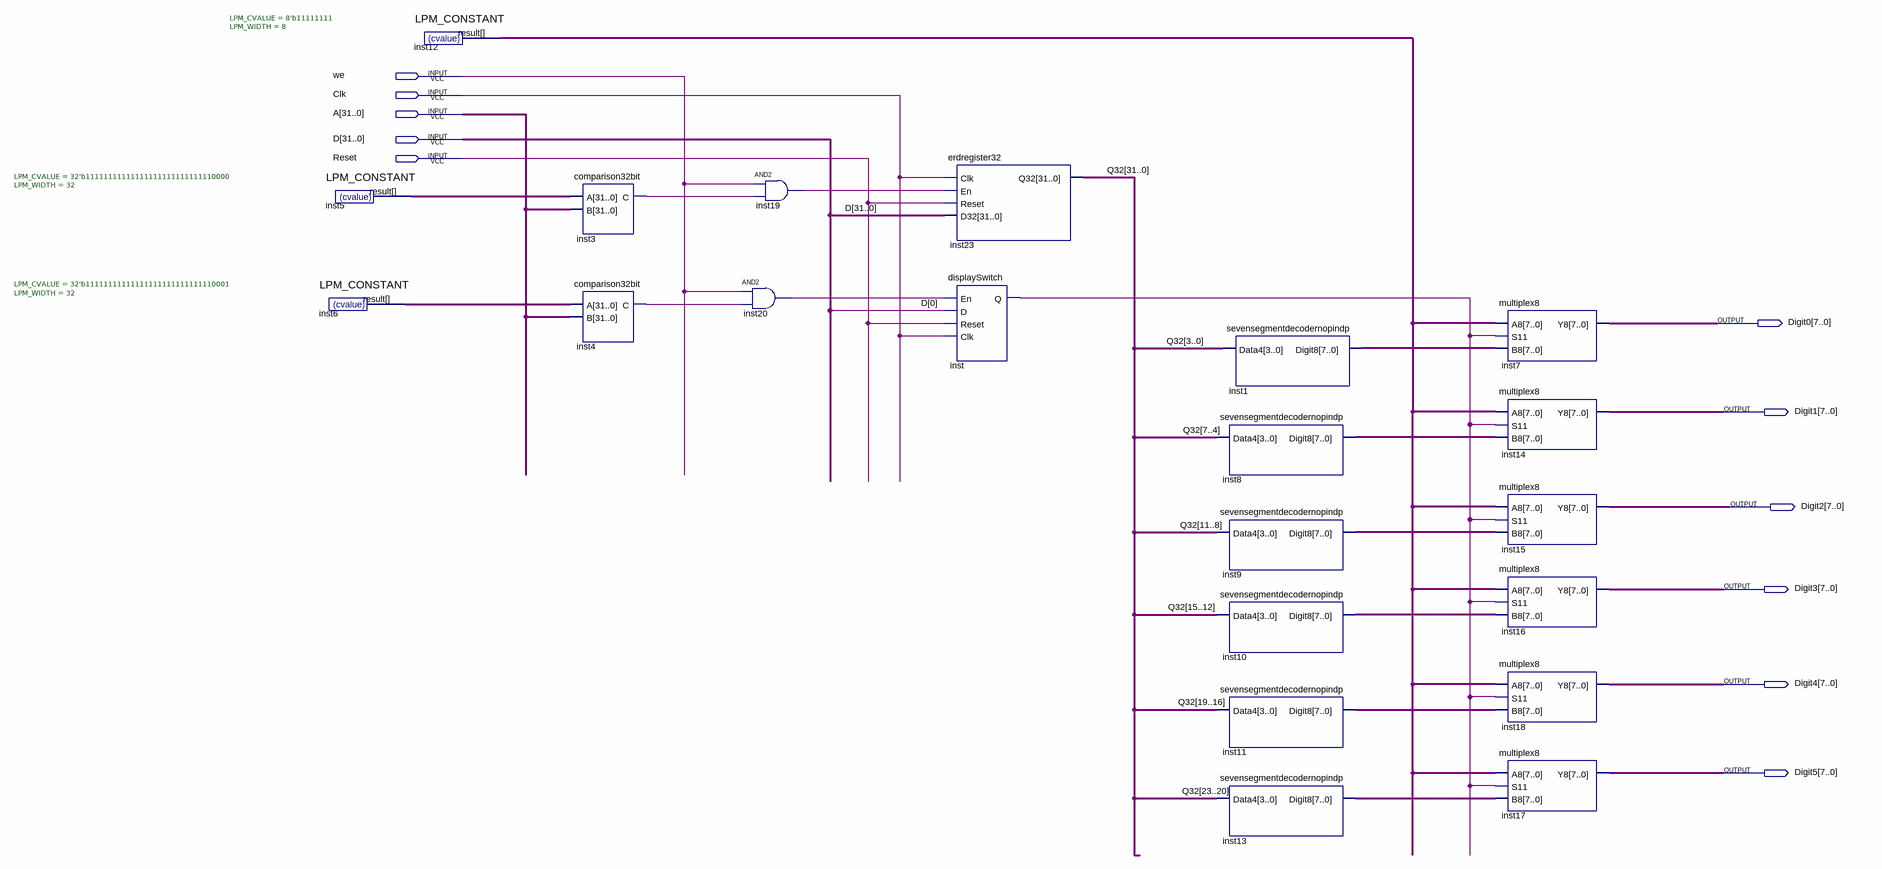
[diagram p0: schematic sheet]
// Quartus schematic rdisplayDriver.bdf as structural Verilog: 21 symbols, 11 pins
module rdisplayDriver (
  input  we,
  input  Clk,
  input  [31:0] A,
  input  [31:0] D,
  input  Reset,
  output [7:0] Digit0,
  output [7:0] Digit1,
  output [7:0] Digit2,
  output [7:0] Digit3,
  output [7:0] Digit4,
  output [7:0] Digit5
);

  wire inst3_c, inst4_c, inst19_out, inst20_out, inst_q;
  wire [7:0] inst1_digit8, inst8_digit8, inst9_digit8, inst10_digit8, inst11_digit8, inst12_result,
       inst13_digit8;
  wire [31:0] inst5_result, inst6_result, Q32;

  LPM_CONSTANT #(.LPM_CVALUE(32'b11111111111111111111111111110000), .LPM_WIDTH(32)) inst5 (.result(inst5_result));
  LPM_CONSTANT #(.LPM_CVALUE(32'b11111111111111111111111111110001), .LPM_WIDTH(32)) inst6 (.result(inst6_result));
  LPM_CONSTANT #(.LPM_CVALUE(8'b11111111), .LPM_WIDTH(8)) inst12 (.result(inst12_result));
  comparison32bit inst3 (.A(inst5_result), .B(A), .C(inst3_c));
  comparison32bit inst4 (.A(inst6_result), .B(A), .C(inst4_c));
  and inst20 (inst20_out, we, inst4_c);
  and inst19 (inst19_out, we, inst3_c);
  erdregister32 inst23 (.Clk(Clk), .En(inst19_out), .Reset(Reset), .D32(D), .Q32(Q32));
  displaySwitch inst (.En(inst20_out), .D(D[0]), .Reset(Reset), .Clk(Clk), .Q(inst_q));
  sevensegmentdecodernopindp inst1 (.Data4(Q32[3:0]), .Digit8(inst1_digit8));
  sevensegmentdecodernopindp inst8 (.Data4(Q32[7:4]), .Digit8(inst8_digit8));
  sevensegmentdecodernopindp inst9 (.Data4(Q32[11:8]), .Digit8(inst9_digit8));
  sevensegmentdecodernopindp inst10 (.Data4(Q32[15:12]), .Digit8(inst10_digit8));
  sevensegmentdecodernopindp inst11 (.Data4(Q32[19:16]), .Digit8(inst11_digit8));
  sevensegmentdecodernopindp inst13 (.Data4(Q32[23:20]), .Digit8(inst13_digit8));
  multiplex8 inst7 (.A8(inst12_result), .S11(inst_q), .B8(inst1_digit8), .Y8(Digit0));
  multiplex8 inst14 (.A8(inst12_result), .S11(inst_q), .B8(inst8_digit8), .Y8(Digit1));
  multiplex8 inst15 (.A8(inst12_result), .S11(inst_q), .B8(inst9_digit8), .Y8(Digit2));
  multiplex8 inst16 (.A8(inst12_result), .S11(inst_q), .B8(inst10_digit8), .Y8(Digit3));
  multiplex8 inst18 (.A8(inst12_result), .S11(inst_q), .B8(inst11_digit8), .Y8(Digit4));
  multiplex8 inst17 (.A8(inst12_result), .S11(inst_q), .B8(inst13_digit8), .Y8(Digit5));
endmodule
